# EAGLE schematic ScanDriver (EAGLE 6.3)
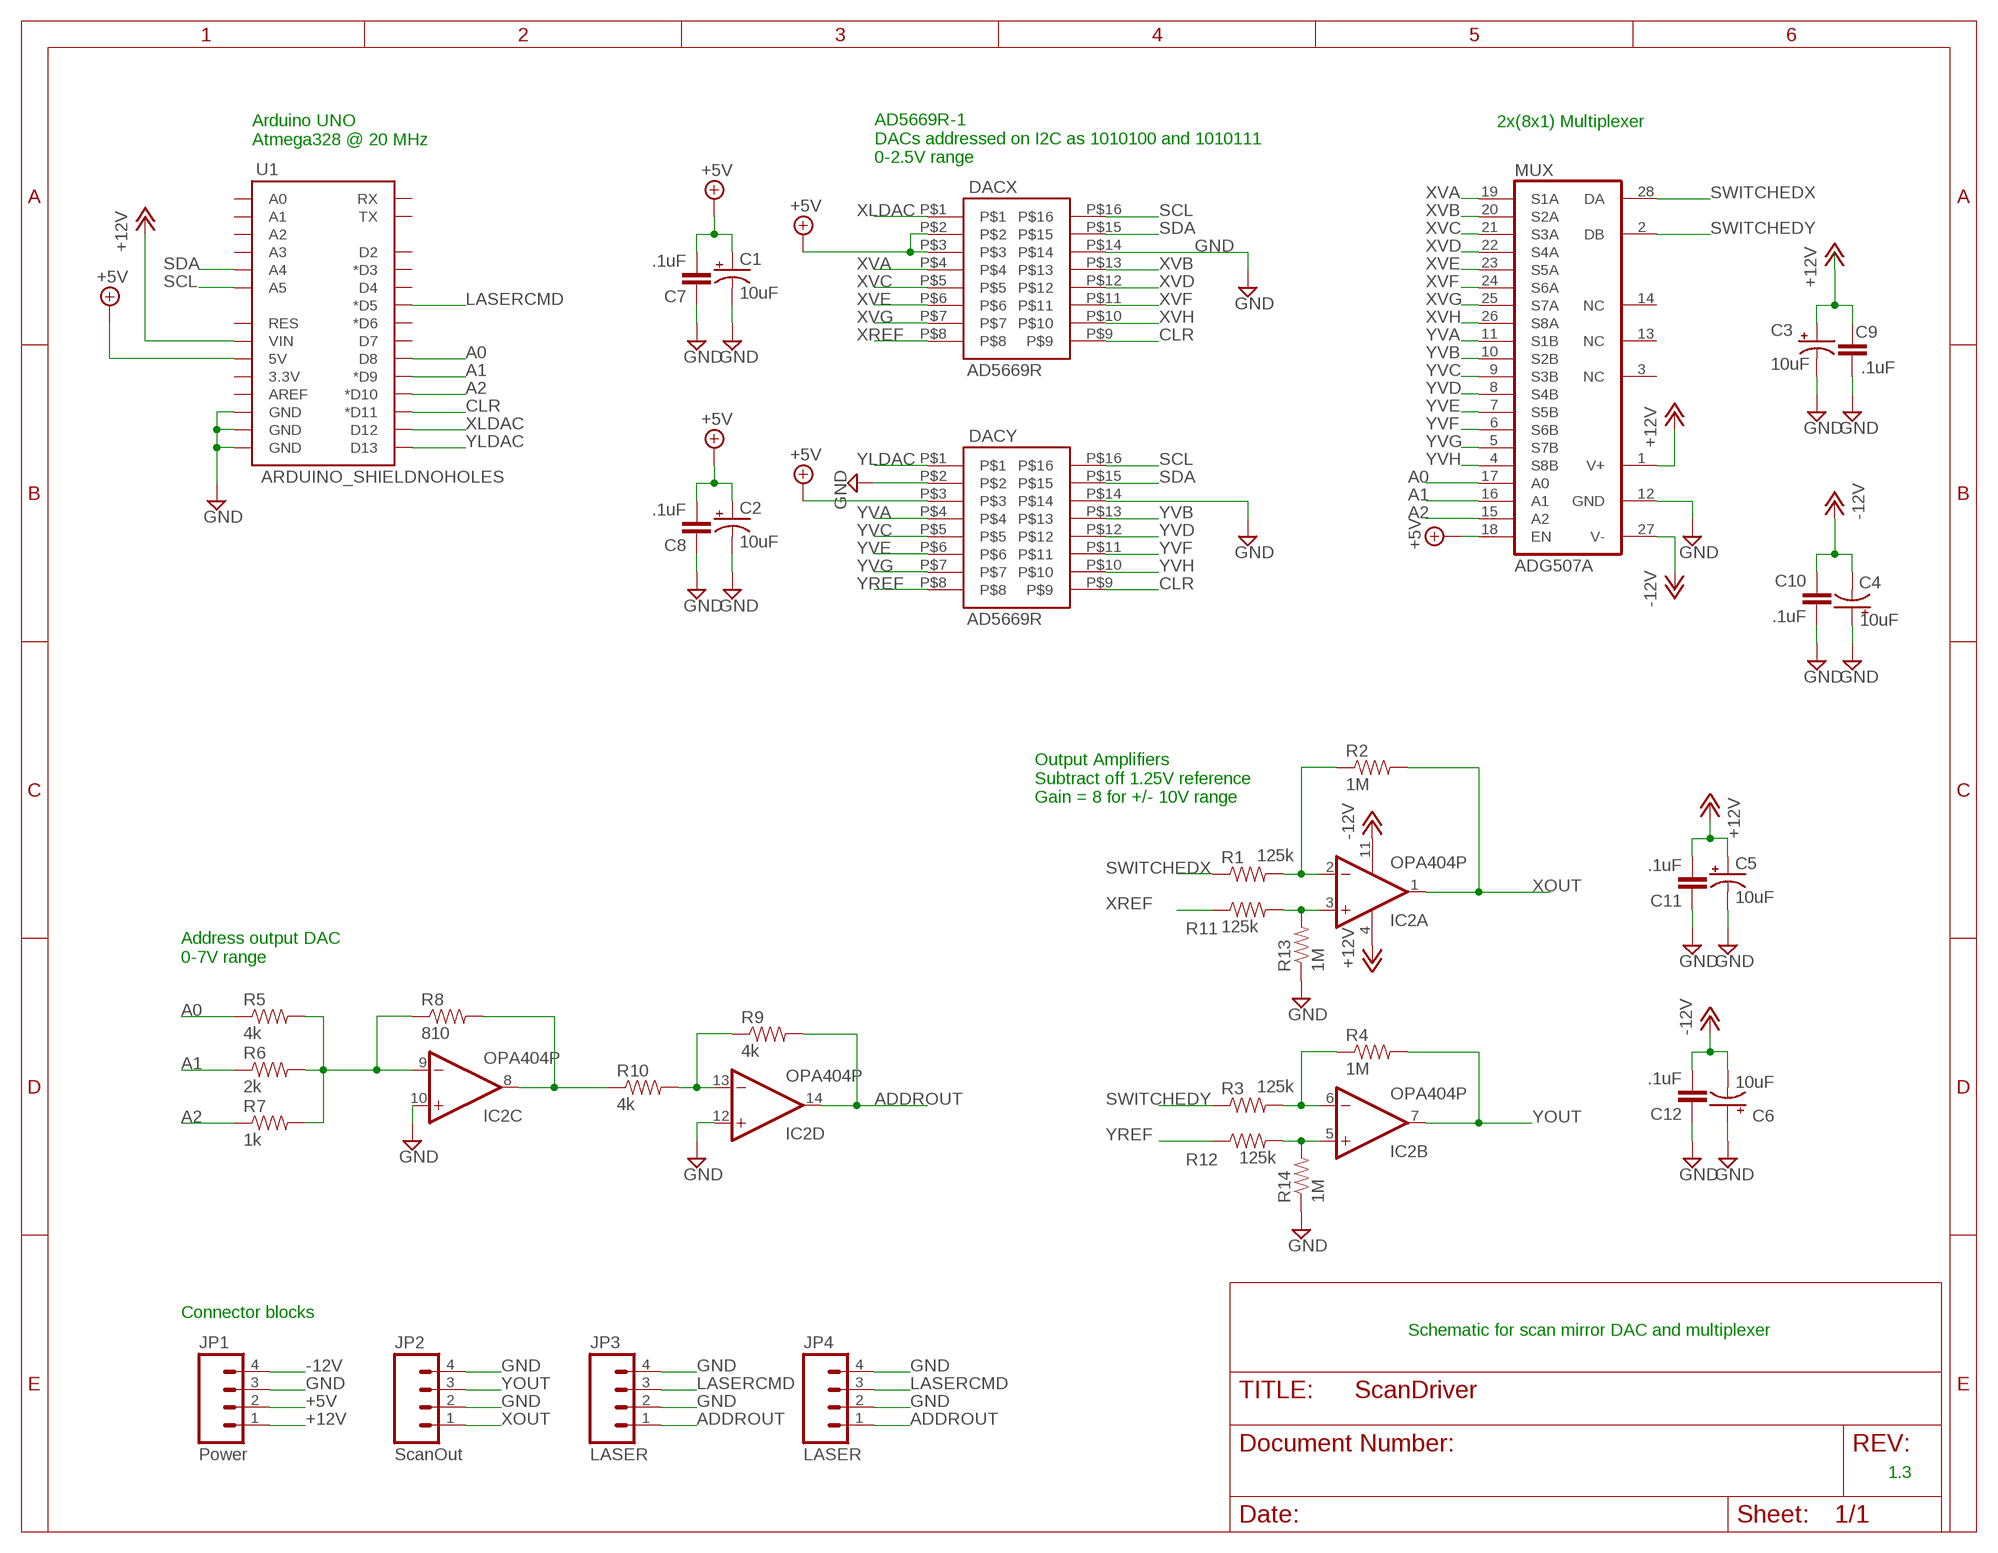
[diagram p0: schematic, sheet 1]

## Parts
C1  10uF  CAP_POLPTH2  [CPOL-RADIAL-10UF-25V]
C2  10uF  CAP_POLPTH2  [CPOL-RADIAL-10UF-25V]
C3  10uF  CAP_POLPTH2  [CPOL-RADIAL-10UF-25V]
C4  10uF  CAP_POLPTH2  [CPOL-RADIAL-10UF-25V]
C5  10uF  CAP_POLPTH2  [CPOL-RADIAL-10UF-25V]
C6  10uF  CAP_POLPTH2  [CPOL-RADIAL-10UF-25V]
C7  .1uF  CAPKIT  [CAP-PTH-SMALL-KIT]
C8  .1uF  CAPKIT  [CAP-PTH-SMALL-KIT]
C9  .1uF  CAPKIT  [CAP-PTH-SMALL-KIT]
C10  .1uF  CAPKIT  [CAP-PTH-SMALL-KIT]
C11  .1uF  CAPKIT  [CAP-PTH-SMALL-KIT]
C12  .1uF  CAPKIT  [CAP-PTH-SMALL-KIT]
DACX  AD5669R  SSOP16  [SSOP16]
DACY  AD5669R  SSOP16  [SSOP16]
IC2  OPA404P  [DIL14]
JP1  Power  M04POLAR  [MOLEX-1X4]
JP2  ScanOut  M04POLAR  [MOLEX-1X4]
JP3  LASER  M04POLAR  [MOLEX-1X4]
JP4  LASER  M04POLAR  [MOLEX-1X4]
MUX  ADG507A  DG507ACJ  [DIL28-6]
R1  125k  RESISTORPTH-1/4W  [AXIAL-0.4]
R2  1M  RESISTORPTH-1/4W  [AXIAL-0.4]
R3  125k  RESISTORPTH-1/4W  [AXIAL-0.4]
R4  1M  RESISTORPTH-1/4W  [AXIAL-0.4]
R5  4k  RESISTORPTH-1/4W  [AXIAL-0.4]
R6  2k  RESISTORPTH-1/4W  [AXIAL-0.4]
R7  1k  RESISTORPTH-1/4W  [AXIAL-0.4]
R8  810  RESISTORPTH-1/4W  [AXIAL-0.4]
R9  4k  RESISTORPTH-1/4W  [AXIAL-0.4]
R10  4k  RESISTORPTH-1/4W  [AXIAL-0.4]
R11  125k  RESISTORPTH-1/4W  [AXIAL-0.4]
R12  125k  RESISTORPTH-1/4W  [AXIAL-0.4]
R13  1M  RESISTORPTH-1/4W  [AXIAL-0.4]
R14  1M  RESISTORPTH-1/4W  [AXIAL-0.4]
U1  ARDUINO_SHIELDNOHOLES  [DUEMILANOVE_SHIELD_NOHOLES]

## Nets
+5V: C1.1(+) C2.1(+) C7.2 C8.2 DACX.P$2 DACX.P$3 DACY.P$3 JP1.2 MUX.18(EN) U1.5V
+12V: C3.1(+) C5.1(+) C9.2 C11.2 IC2.4(P:V+) JP1.1 MUX.1(V+) U1.VIN
-12V: C4.2(-) C6.2(-) C10.2 C12.2 IC2.11(P:V-) JP1.4 MUX.27(V-)
A0: MUX.17(A0) R5.P$1 U1.D8
A1: MUX.16(A1) R6.P$1 U1.D9(*D9)
A2: MUX.15(A2) R7.P$1 U1.D10(*D10)
ADDROUT: IC2.14(D:OUT) JP3.1 JP4.1 R9.P$2
CLR: DACX.P$9 DACY.P$9 U1.D11(*D11)
GND: C1.2(-) C2.2(-) C3.2(-) C4.1(+) C5.2(-) C6.1(+) C7.1 C8.1 C9.1 C10.1 C11.1 C12.1 DACX.P$14 DACY.P$2 DACY.P$14 IC2.10(C:+IN) IC2.12(D:+IN) JP1.3 JP2.2 JP2.4 JP3.2 JP3.4 JP4.2 JP4.4 MUX.12(GND) R13.P$1 R14.P$1 U1.GND@0(GND) U1.GND@1(GND) U1.GND@2(GND)
LASERCMD: JP3.3 JP4.3 U1.D5(*D5)
N$1: IC2.2(A:-IN) R1.P$2 R2.P$1
N$2: IC2.6(B:-IN) R3.P$2 R4.P$1
N$3: IC2.9(C:-IN) R5.P$2 R6.P$2 R7.P$2 R8.P$1
N$4: IC2.8(C:OUT) R8.P$2 R10.P$1
N$5: IC2.13(D:-IN) R9.P$1 R10.P$2
N$17: IC2.3(A:+IN) R11.P$2 R13.P$2
N$19: IC2.5(B:+IN) R12.P$2 R14.P$2
SCL: DACX.P$16 DACY.P$16 U1.A5
SDA: DACX.P$15 DACY.P$15 U1.A4
SWITCHEDX: MUX.28(DA) R1.P$1
SWITCHEDY: MUX.2(DB) R3.P$1
XLDAC: DACX.P$1 U1.D12
XOUT: IC2.1(A:OUT) JP2.1 R2.P$2
XREF: DACX.P$8 R11.P$1
XVA: DACX.P$4 MUX.19(S1A)
XVB: DACX.P$13 MUX.20(S2A)
XVC: DACX.P$5 MUX.21(S3A)
XVD: DACX.P$12 MUX.22(S4A)
XVE: DACX.P$6 MUX.23(S5A)
XVF: DACX.P$11 MUX.24(S6A)
XVG: DACX.P$7 MUX.25(S7A)
XVH: DACX.P$10 MUX.26(S8A)
YLDAC: DACY.P$1 U1.D13
YOUT: IC2.7(B:OUT) JP2.3 R4.P$2
YREF: DACY.P$8 R12.P$1
YVA: DACY.P$4 MUX.11(S1B)
YVB: DACY.P$13 MUX.10(S2B)
YVC: DACY.P$5 MUX.9(S3B)
YVD: DACY.P$12 MUX.8(S4B)
YVE: DACY.P$6 MUX.7(S5B)
YVF: DACY.P$11 MUX.6(S6B)
YVG: DACY.P$7 MUX.5(S7B)
YVH: DACY.P$10 MUX.4(S8B)
Unconnected: MUX.3(NC) MUX.13(NC) MUX.14(NC) U1.3.3V U1.A0 U1.A1 U1.A2 U1.A3 U1.AREF U1.D2 U1.D3(*D3) U1.D4 U1.D6(*D6) U1.D7 U1.RES U1.RX U1.TX

## Notes on the sheet
- 2x(8x1) Multiplexer
- Arduino UNO
  Atmega328 @ 20 MHz
- AD5669R-1
  DACs addressed on I2C as 1010100 and 1010111
  0-2.5V range
- Output Amplifiers
  Subtract off 1.25V reference
  Gain = 8 for +/- 10V range
- Address output DAC
  0-7V range
- Connector blocks
- Schematic for scan mirror DAC and multiplexer
- 1.3

## Library data of the parts
C1-C6 = SparkFun:CAP_POL: Capacitor Polarized These are standard SMD and PTH capacitors. Normally 10uF, 47uF, and 100uF in electrolytic and tantalum varieties. Always verify the external diameter of the through hole cap, it varies with capacity, voltage, and manufacturer. The EIA devices should be standard.
C7-C12 = SparkFun:CAP: Capacitor Standard 0603 ceramic capacitor, and 0.1" leaded capacitor.
DACX DACY = SparkFun:SSOP16
IC2 = linear:OPA404: OP AMP
JP1-JP4 = SparkFun:M04: Header 4 Standard 4-pin 0.1" header. Use with straight break away headers (SKU : PRT-00116), right angle break away headers (PRT-00553), swiss pins (PRT-00743), machine pins (PRT-00117), and female headers (PRT-00115). Molex polarized connector foot print use with SKU : PRT-08231 with associated crimp pins and housings. 1MM SMD Version SKU: PRT-10208
MUX = maxim:DG507ACJ: MULTIPLEXER; MPN: DG507ACJ+; OC_FARNELL: 1077079; OC_NEWARK: 18M9071
R1-R14 = SparkFun:RESISTOR: Resistor Basic schematic elements and footprints for 0603, 1206, and PTH resistors.
U1 = SparkFun:ARDUINO_SHIELD